# EAGLE design M3_Shield_Solar_V1.2 (EAGLE 9.5.2)
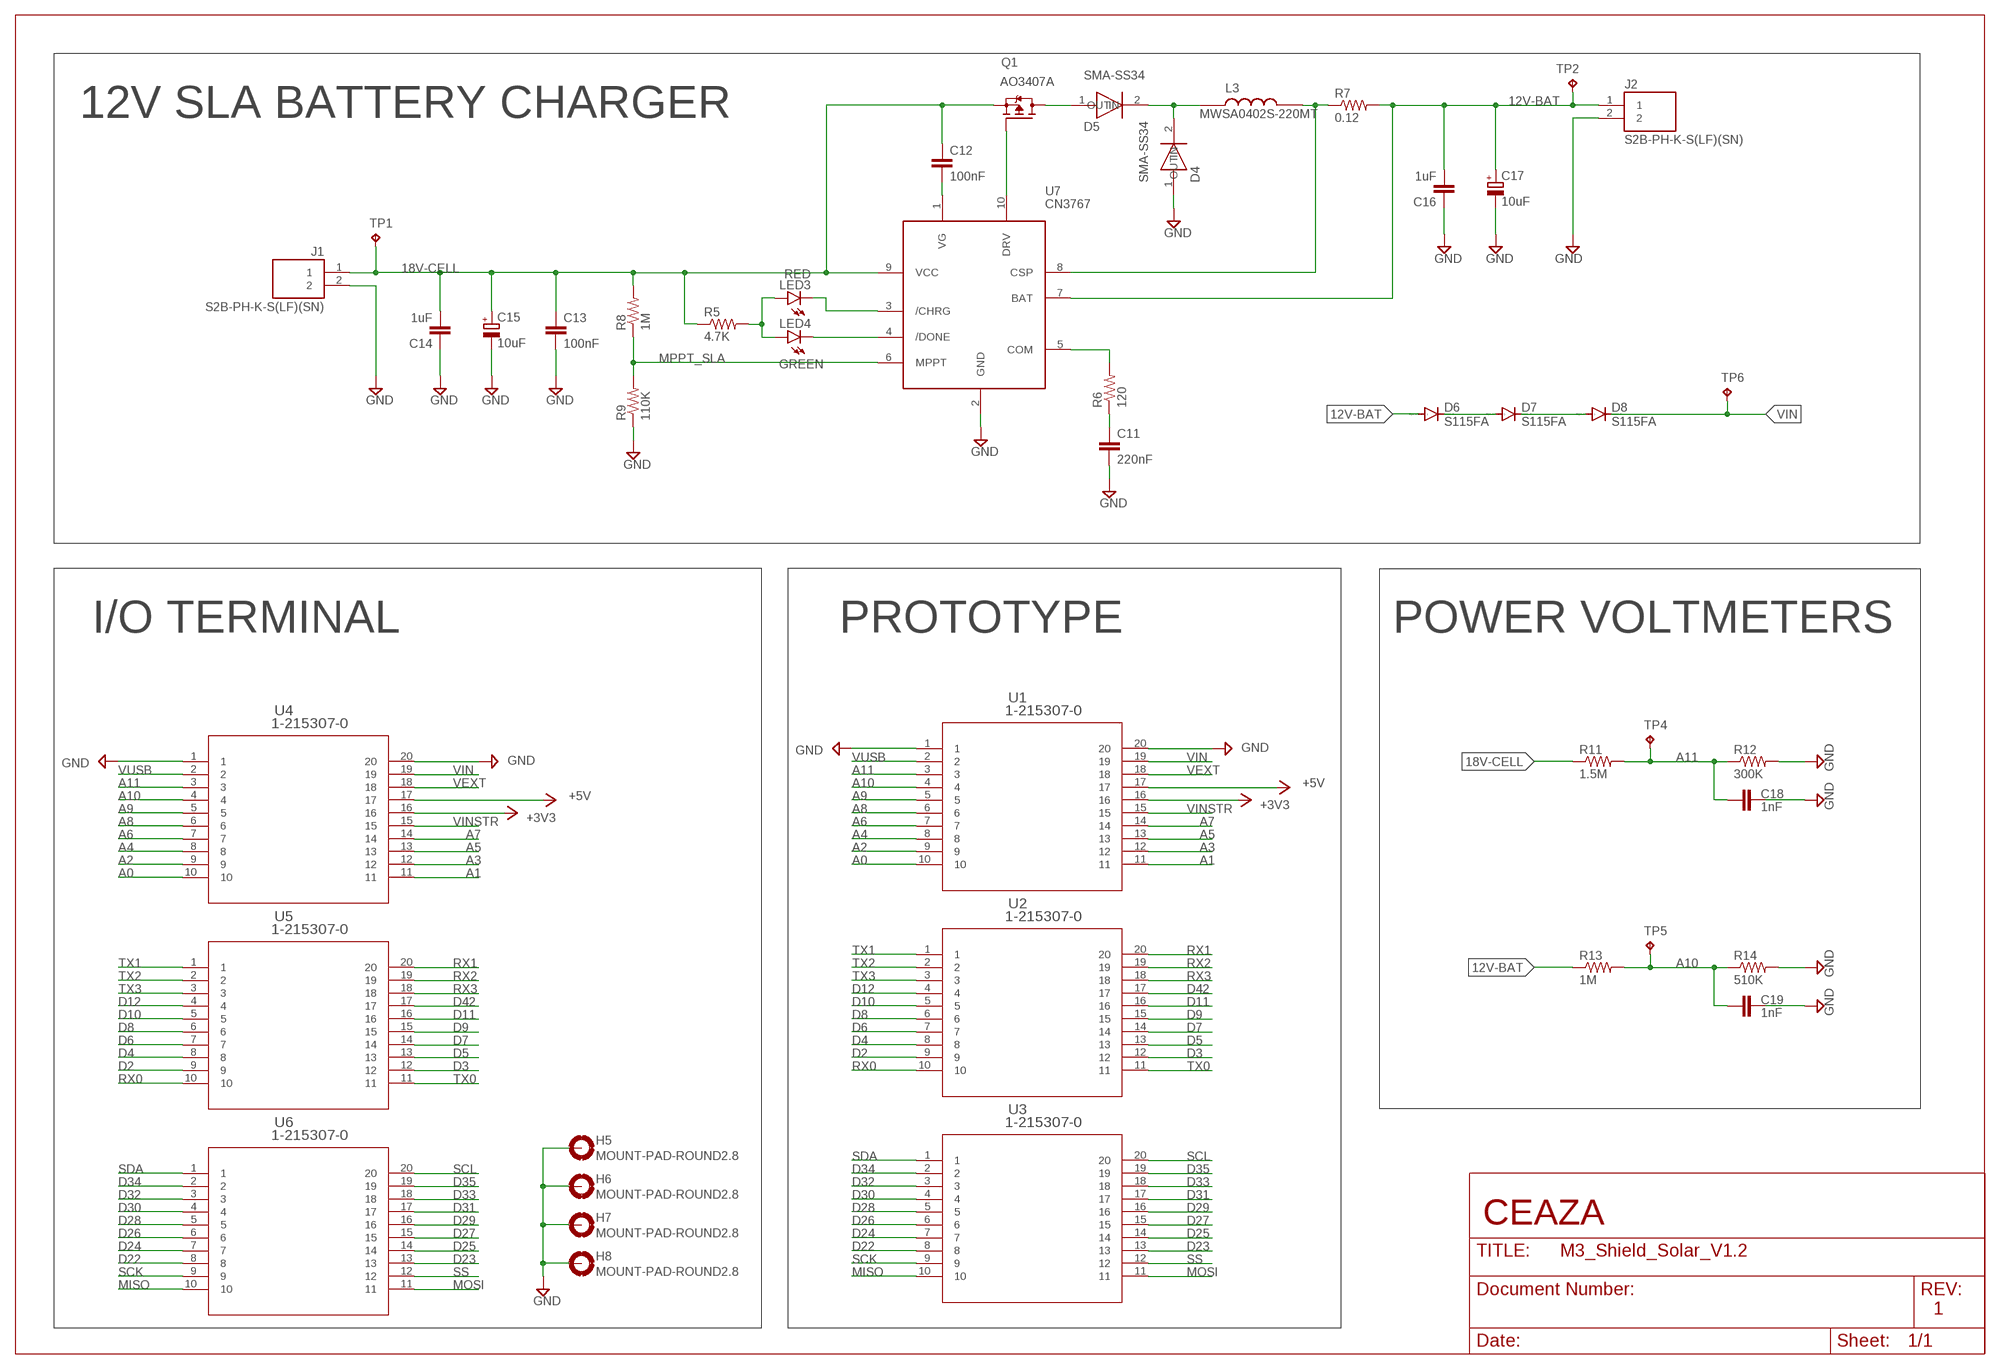
[diagram p0: schematic, sheet 1]

## Parts
C11  220nF  C-EUC0603K  [C0603K]
C12  100nF  C-EUC0603K  [C0603K]
C13  100nF  C-EUC0603K  [C0603K]
C14  1uF  C-EUC0603K  [C0603K]
C15  10uF  CPOL-EU153CLV-0505  [153CLV-0505]
C16  1uF  C-EUC0603K  [C0603K]
C17  10uF  CPOL-EU153CLV-0505  [153CLV-0505]
C18  1nF  C-EUC0603K  [C0603K]
C19  1nF  C-EUC0603K  [C0603K]
D4  SMA-SS34  [SMA-SS34]
D5  SMA-SS34  [SMA-SS34]
D6  S115FA  CGRM4001-G  [SOD-123_MINI-SMA]
D7  S115FA  CGRM4001-G  [SOD-123_MINI-SMA]
D8  S115FA  CGRM4001-G  [SOD-123_MINI-SMA]
H5  MOUNT-PAD-ROUND2.8  [2,8-PAD]
H6  MOUNT-PAD-ROUND2.8  [2,8-PAD]
H7  MOUNT-PAD-ROUND2.8  [2,8-PAD]
H8  MOUNT-PAD-ROUND2.8  [2,8-PAD]
J1  S2B-PH-K-S(LF)(SN)  [JST_S2B-PH-K-S(LF)(SN)]
J2  S2B-PH-K-S(LF)(SN)  [JST_S2B-PH-K-S(LF)(SN)]
L3  MWSA0402S-220MT  [MWSA0402S-220MT]
LED3  RED  LEDCHIPLED_0603  [CHIPLED_0603]
LED4  GREEN  LEDCHIPLED_0603  [CHIPLED_0603]
Q1  AO3407A  [SOT95P280X125-3N]
R5  4.7K  R-US_R0603  [R0603]
R6  120  R-US_R0603  [R0603]
R7  0.12  R-US_R0805  [R0805]
R8  1M  R-US_R0603  [R0603]
R9  110K  R-US_R0603  [R0603]
R11  1.5M  R-US_R0603  [R0603]
R12  300K  R-US_R0603  [R0603]
R13  1M  R-US_R0603  [R0603]
R14  510K  R-US_R0603  [R0603]
TP1  TPB1,27  [B1,27]
TP2  TPB1,27  [B1,27]
TP4  TPB1,27  [B1,27]
TP5  TPB1,27  [B1,27]
TP6  TPB1,27  [B1,27]
U1  1-215307-0  [1-215307-0]
U2  1-215307-0  [1-215307-0]
U3  1-215307-0  [1-215307-0]
U4  1-215307-0  [1-215307-0]
U5  1-215307-0  [1-215307-0]
U6  1-215307-0  [1-215307-0]
U7  CN3767  [CN3767]

## Nets
12V-BAT: C16.2 C17.+ D6.A J2.1 R7.2 R13.1 TP2.TP U7.7(BAT)
18V-CELL: C12.1 C13.1 C14.2 C15.+ J1.1 Q1.2(S) R5.1 R8.2 R11.1 TP1.TP U7.9(VCC)
+3V3: U1.16 U4.16
+5V: U1.17 U4.17
A0: U1.10 U4.10
A1: U1.11 U4.11
A2: U1.9 U4.9
A3: U1.12 U4.12
A4: U1.8 U4.8
A5: U1.13 U4.13
A6: U1.7 U4.7
A7: U1.14 U4.14
A8: U1.6 U4.6
A9: U1.5 U4.5
A10: C19.1 R13.2 R14.1 TP5.TP U1.4 U4.4
A11: C18.1 R11.2 R12.1 TP4.TP U1.3 U4.3
D2: U2.9 U5.9
D3: U2.12 U5.12
D4: U2.8 U5.8
D5: U2.13 U5.13
D6: U2.7 U5.7
D7: U2.14 U5.14
D8: U2.6 U5.6
D9: U2.15 U5.15
D10: U2.5 U5.5
D11: U2.16 U5.16
D12: U2.4 U5.4
D22: U3.8 U6.8
D23: U3.13 U6.13
D24: U3.7 U6.7
D25: U3.14 U6.14
D26: U3.6 U6.6
D27: U3.15 U6.15
D28: U3.5 U6.5
D29: U3.16 U6.16
D30: U3.4 U6.4
D31: U3.17 U6.17
D32: U3.3 U6.3
D33: U3.18 U6.18
D34: U3.2 U6.2
D35: U3.19 U6.19
D42: U2.17 U5.17
GND: C11.2 C13.2 C14.1 C15.- C16.1 C17.- C18.2 C19.2 D4.1(IN) H5.B2,8(MOUNT) H6.B2,8(MOUNT) H7.B2,8(MOUNT) H8.B2,8(MOUNT) J1.2 J2.2 R9.1 R12.2 R14.2 U1.1 U1.20 U4.1 U4.20 U7.2(GND)
MISO: U3.10 U6.10
MOSI: U3.11 U6.11
MPPT_SLA: R8.1 R9.2 U7.6(MPPT)
N$6: LED4.C U7.4(/DONE)
N$9: LED3.C U7.3(/CHRG)
N$10: LED3.A LED4.A R5.2
N$13: R6.2 U7.5(COM)
N$14: C11.1 R6.1
N$15: D6.C D7.A
N$16: D7.C D8.A
N$17: L3.P$2 R7.1 U7.8(CSP)
N$20: D4.2(OUT) D5.2(OUT) L3.P$1
N$23: C12.2 U7.1(VG)
N$24: Q1.1(G) U7.10(DRV)
N$25: D5.1(IN) Q1.3(D)
RX0: U2.10 U5.10
RX1: U2.20 U5.20
RX2: U2.19 U5.19
RX3: U2.18 U5.18
SCK: U3.9 U6.9
SCL: U3.20 U6.20
SDA: U3.1 U6.1
SS: U3.12 U6.12
TX0: U2.11 U5.11
TX1: U2.1 U5.1
TX2: U2.2 U5.2
TX3: U2.3 U5.3
VEXT: U1.18 U4.18
VIN: D8.C TP6.TP U1.19 U4.19
VINSTR: U1.15 U4.15
VUSB: U1.2 U4.2

## Notes on the sheet
- 12V SLA BATTERY CHARGER
- I/O TERMINAL | PROTOTYPE | POWER VOLTMETERS
- CEAZA
- 1

## Library data of the parts
C11-C14 C16 C18 C19 = rcl:C-EU: CAPACITOR, European symbol; SPICEPREFIX: C
C15 C17 = rcl:CPOL-EU: POLARIZED CAPACITOR, European symbol; SPICEPREFIX: C
D4 D5 = SMA-SS34:SMA-SS34
D6-D8 = diode:CGRM400*-G: Molded plasitc,JEDEC SOD-123/Mini SMA Source: Comchip CGRM4001-G.pdf
H5-H8 = holes:MOUNT-PAD-ROUND: MOUNTING PAD, round
J1 J2 = S2B-PH-K-S_LF__SN_:S2B-PH-K-S(LF)(SN): PH Series 2 Position 2.0 mm Through Hole Side Entry Shrouded Header; DESCRIPTION: Connector Header Through Hole, Right Angle 2 position; DIGI-KEY_PART_NUMBER: 455-1719-ND; DIGI-KEY_PURCHASE_URL: https://www.digikey.com/product-detail/en/jst-sales-america-inc/S2B-PH-K-S_LF__SN_/455-1719-ND/926626?utm_source=snapeda&utm_medium=aggregator&utm_campaign=symbol; MF: JST Sales America Inc.; MP: S2B-PH-K-S_LF__SN_; PACKAGE: Custom Package JST Sales America Inc.
L3 = MWSA0402S-220MT:MWSA0402S-220MT
LED3 LED4 = led:LED: LED OSRAM: - CHIPLED LG R971, LG N971, LY N971, LG Q971, LY Q971, LO R971, LY R971 LH N974, LH R974 LS Q976, LO Q976, LY Q976 LO Q996 - Hyper CHIPLED LW Q18S LB Q993, LB Q99A, LB R99A - SideLED LS A670, LO A670, LY A670, LG A670, LP A670 LB A673, LV A673, LT A673, LW A673 LH A674 LY A675 LS A676, LA A676, LO A676, LY A676, LW A676 LS A679, LY A679, LG A679 - Hyper Micro SIDELED® LS Y876, LA Y876, LO Y876, LY Y876 LT Y87S - SmartLED LW L88C, LW L88S LB L89C, LB L89S, LG L890 LS L89K, LO L89K, LY L89K LS L896, LA L896, LO L896, LY L896 - TOPLED LS T670, LO T670, LY T670, LG T670, LP T670 LSG T670, LSP T670, LSY T670, LOP T670, LYG T670 LG T671, LOG T671, LSG T671 LB T673, LV T673, LT T673, LW T673 LH T674 LS T676, LA T676, LO T676, LY T676, LB T676, LH T676, LSB T676, LW T676 LB T67C, LV T67C, LT T67C, LS T67K, LO T67K, LY T67K, LW E67C LS E67B, LA E67B, LO E67B, LY E67B, LB E67C, LV E67C, LT E67C LW T67C LS T679, LY T679, LG T679 LS T770, LO T770, LY T770, LG T770, LP T770 LB T773, LV T773, LT T773, LW T773 LH T774 LS E675, LA E675, LY E675, LS T675 LS T776, LA T776, LO T776, LY T776, LB T776 LHGB T686 LT T68C, LB T68C - Hyper Mini TOPLED® LB M676 - Mini TOPLED Santana® LG M470 LS M47K, LO M47K, LY M47K Source: http://www.osram.convergy.de LUXEON: - LUMILED® LXK2-PW12-R00, LXK2-PW12-S00, LXK2-PW14-U00, LXK2-PW14-V00 LXK2-PM12-R00, LXK2-PM12-S00, LXK2-PM14-U00 LXK2-PE12-Q00, LXK2-PE12-R00, LXK2-PE12-S00, LXK2-PE14-T00, LXK2-PE14-U00 LXK2-PB12-K00, LXK2-PB12-L00, LXK2-PB12-M00, LXK2-PB14-N00, LXK2-PB14-P00, LXK2-PB14-Q00 LXK2-PR12-L00, LXK2-PR12-M00, LXK2-PR14-Q00, LXK2-PR14-R00 LXK2-PD12-Q00, LXK2-PD12-R00, LXK2-PD12-S00 LXK2-PH12-R00, LXK2-PH12-S00 LXK2-PL12-P00, LXK2-PL12-Q00, LXK2-PL12-R00 Source: www.luxeon.com KINGBRIGHT: KA-3528ASYC Source: www.kingbright.com
Q1 = AO3407A:AO3407A: Transistor: P-MOSFET; unipolar; -30V; -4.3A; 1.4W; DESCRIPTION: P-Channel 30V 4.3A (Ta) 1.4W (Ta) Surface Mount SOT-23-3L; DIGI-KEY_PART_NUMBER: 785-1006-1-ND; DIGIKEY-PURCHASE-URL: https://snapeda.com/shop?store=DigiKey&id=547767; MF: Alpha &; MP: AO3407A; PACKAGE: SOT-23 Alpha &amp; Omega Semiconductor
R5-R9 R11-R14 = rcl:R-US_: RESISTOR, American symbol; SPICEPREFIX: R
TP1 TP2 TP4-TP6 = testpad:TP: Test pad
U1-U6 = 1-215307-0:1-215307-0; BUILT_BY: EMA_UL_Team; MANUFACTURER_PART_NUMBER: 1-215307-0; VENDOR: TE Connectivity
U7 = CN3767:CN3767

## Board
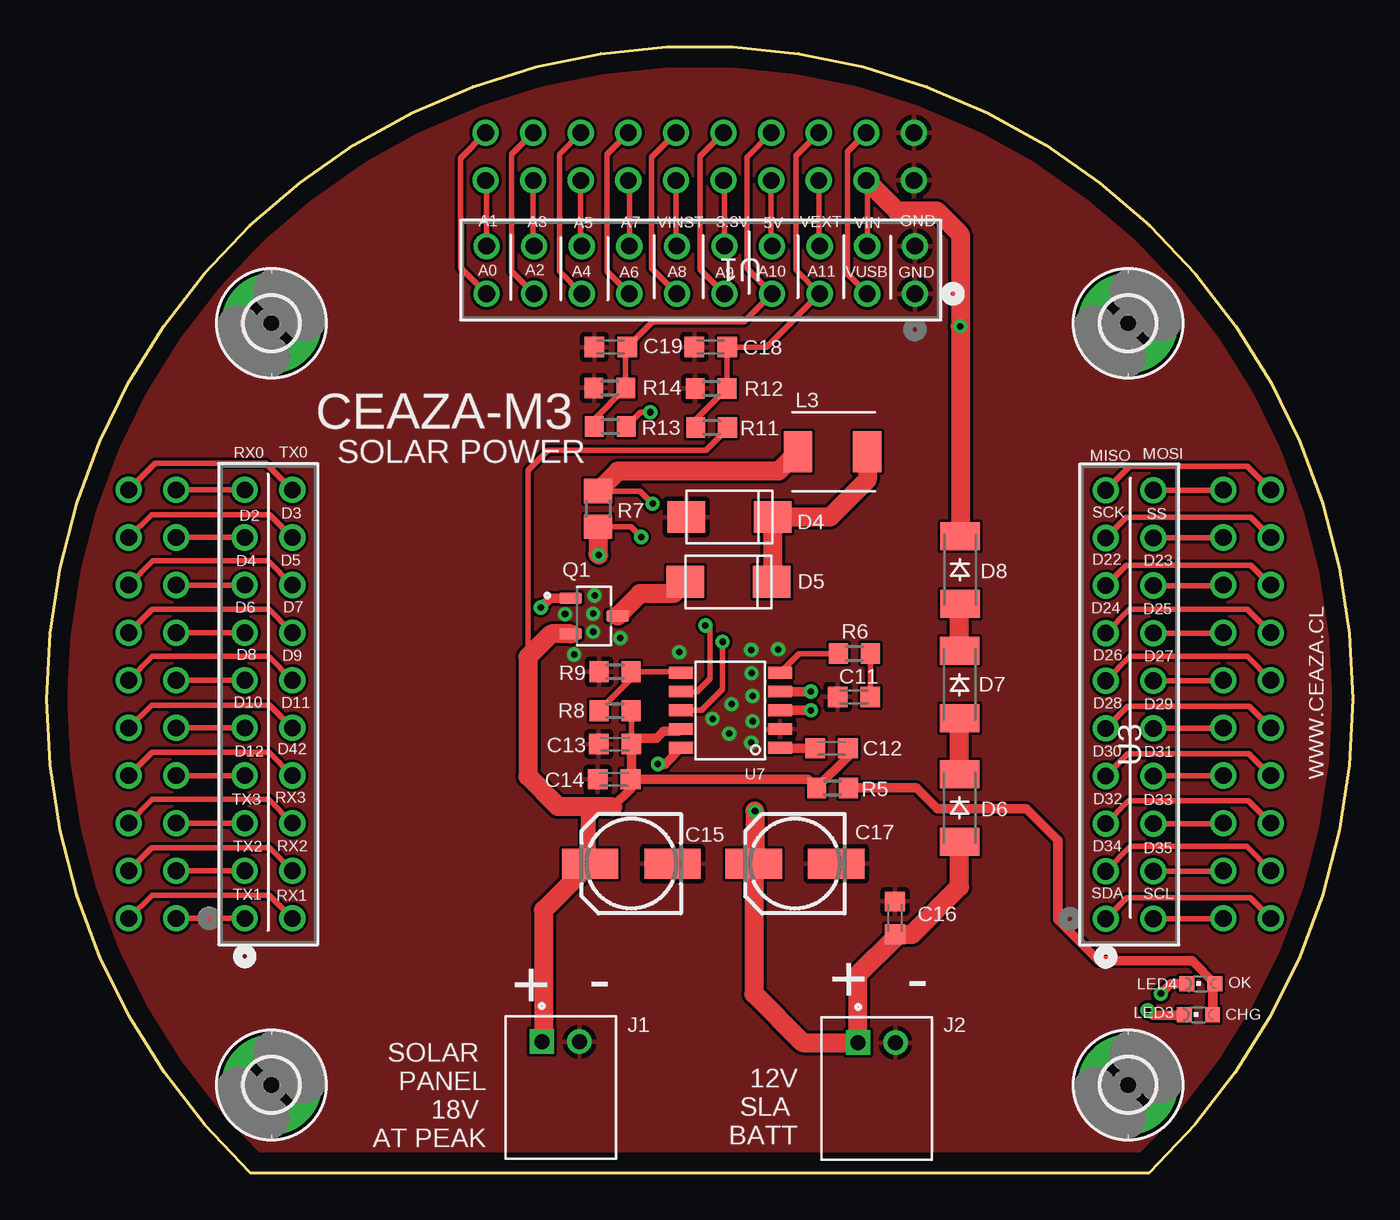
[diagram p1: board, top side]
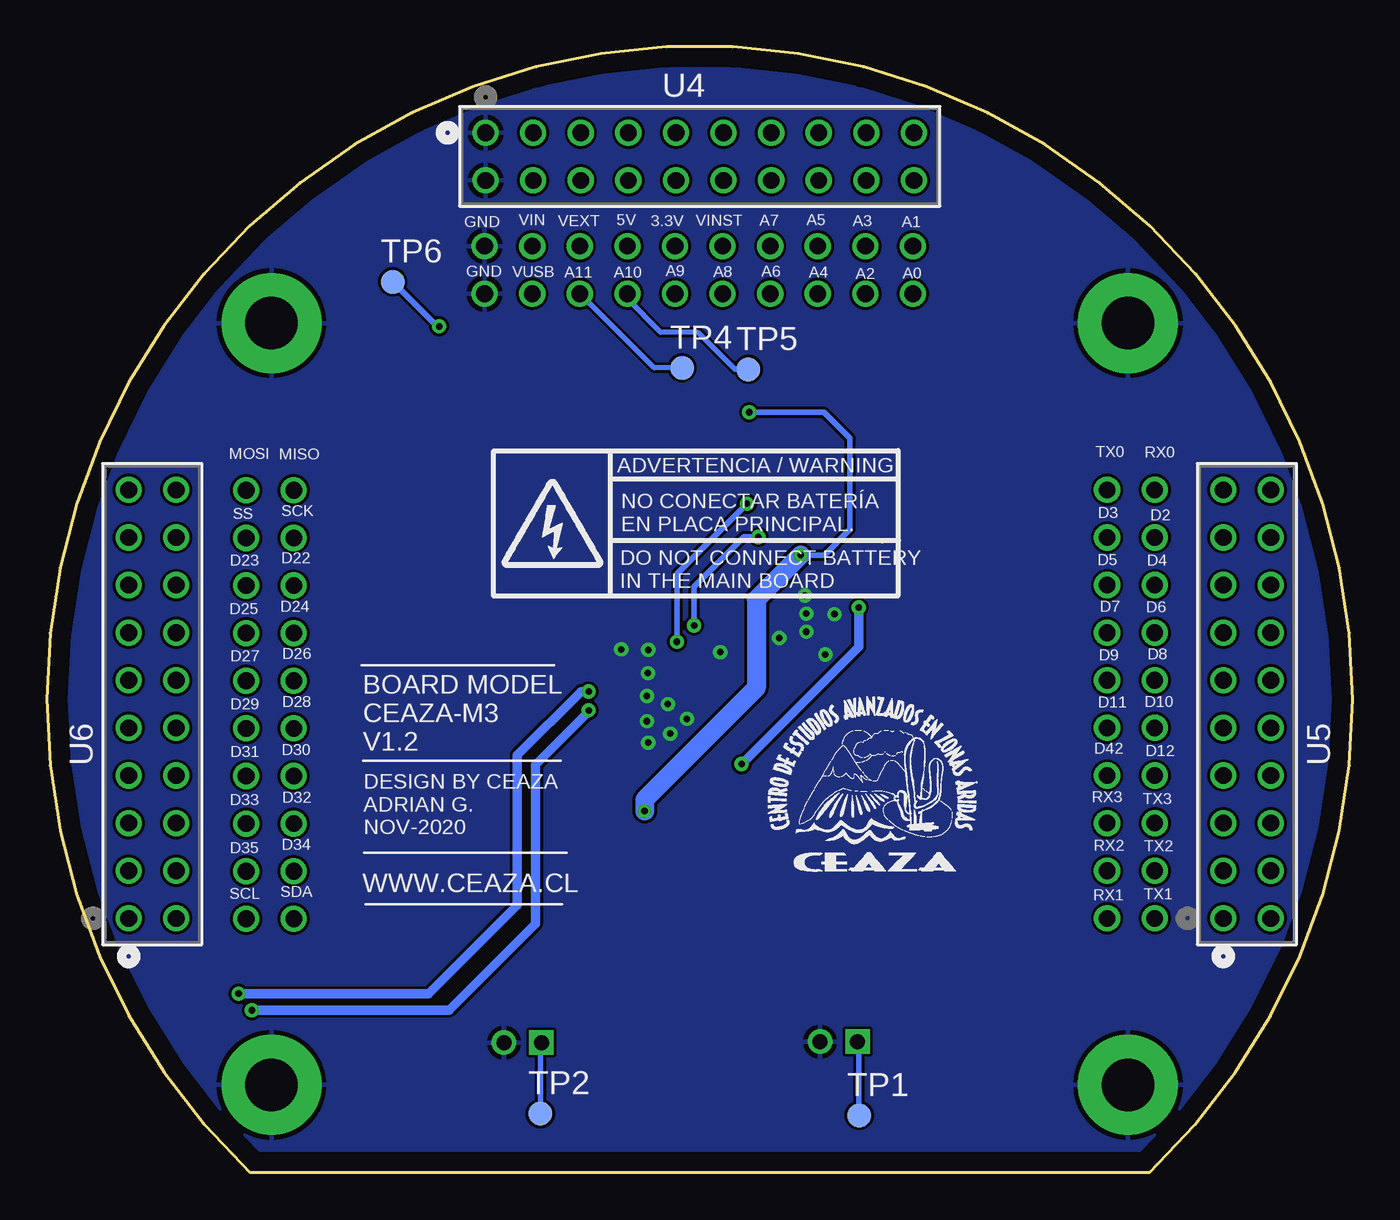
[diagram p2: board, bottom side, seen from below]

Size 69.69 x 60.06 mm. Coordinates in mm from the lower left corner, seen from the top.
Outline: 10.85,0 58.85,0 arc273 10.85,0
Copper layers (1*16): Top 0.035mm / dielectric 1.5mm / Bottom 0.035mm
Design rules "default *": minimum track width 6mil, minimum drill 0.35mm, track to track 6mil, track to pad 6mil, pad to pad 6mil, via to via 6mil, smd to smd 6mil, copper to edge 40mil, drill to drill 6mil, minimum pad ring 10mil, minimum via ring 8mil, stop-mask expansion 2mil, vias tented up to drill 24mil, thermal gap 10mil

### Footprints (pad centres in the part's own frame; a part is rotated, then mirrored left to right if it is on the bottom)
C0603K = smd 1.05 x 1.08: 1 -0.875,0; 2 0.875,0
153CLV-0505 = smd 3 x 1.6: + 2.2,0; - -2.2,0
SMA-SS34 = smd 2 x 1.7: 1 0,-1.4; 2 4.6,-1.4
SOD-123_MINI-SMA = smd 1.5 x 2.1: A 1.8,0; C -1.8,0
2,8-PAD = drill 2.8 pad 5.334: B2,8 0,0
JST_S2B-PH-K-S(LF)(SN) = drill 0.8 square: 1 -1,0 | drill 0.8: 2 1,0
MWSA0402S-220MT = smd 1.5 x 2.2: P$1 -1.8,0; P$2 1.9,0
CHIPLED_0603 = smd 0.8 x 0.8: A 0,-0.75; C 0,0.75
SOT95P280X125-3N = smd 1.21 x 0.59: 1 -1.255,0.95; 2 -1.255,-0.95; 3 1.255,0
R0603 = smd 1 x 1.1: 1 -0.85,0; 2 0.85,0
R0805 = smd 1.3 x 1.5: 1 -0.95,0; 2 0.95,0
B1,27 = smd 1.27 x 1.27: TP 0,0
1-215307-0 = drill 0.889 pad 1.397: 1 -22.86,2.54; 2 -20.32,2.54; 3 -17.78,2.54; 4 -15.24,2.54; 5 -12.7,2.54; 6 -10.16,2.54; 7 -7.62,2.54; 8 -5.08,2.54; 9 -2.54,2.54; 10 0,2.54; 11 0,0; 12 -2.54,0; 13 -5.08,0; 14 -7.62,0; 15 -10.16,0; 16 -12.7,0; 17 -15.24,0; 18 -17.78,0; 19 -20.32,0; 20 -22.86,0
CN3767 = smd 1.27 x 0.635: 1 -2.6,2; 2 -2.6,1; 3 -2.6,0; 4 -2.6,-1; 5 -2.6,-2; 6 2.67,-2; 7 2.67,-1; 8 2.67,0; 9 2.67,1; 10 2.67,2

### Placement (x,y rotation side)
C11  43.08,25.38 180 top
C12  41.88,22.64 180 top
C13  30.32,22.87 180 top
C14  30.27,20.99 0 top
C15  31.19,16.49 180 top
C16  45.26,13.6 270 top
C17  39.93,16.49 180 top
C18  35.43,44.05 180 top
C19  30.1,44.05 180 top
D4  34.13,36.38 0 top
D5  34.08,32.92 0 top
D6  48.71,19.46 270 top
D7  48.71,26.04 270 top
D8  48.74,32.16 270 top
H5  57.71,45.32 0 top
H6  11.99,45.32 0 top
H7  11.99,4.68 0 top
H8  57.71,4.68 0 top
J1  27.43,6.99 0 top
J2  44.29,6.94 0 top
L3  41.98,38.46 180 top
LED3  61.46,8.44 90 top
LED4  61.59,10.09 90 top
Q1  29.21,29.7 0 top
R5  41.93,20.53 0 top
R6  43.1,27.69 180 top
R7  29.41,35.41 270 top
R8  30.32,24.64 0 top
R9  30.32,26.73 0 top
R11  35.48,39.76 180 top
R12  35.46,41.84 180 top
R13  30.07,39.81 180 top
R14  30.05,41.87 180 top
TP1  26.34,3.05 0 bottom
TP2  43.35,3.16 0 bottom
TP4  35.79,42.93 0 bottom
TP5  32.25,42.86 0 bottom
TP6  51.23,47.53 0 bottom
U1  23.47,49.43 180 top
U2  13.1,36.43 90 top
U3  59.05,36.4 90 top
U4  23.42,52.94 0 bottom
U5  4.37,36.43 90 bottom
U6  62.79,36.43 90 bottom
U7  36.52,24.67 180 top

### Tracks (layer width: path | path; a pad name or v marks a point on that pad's centre or on a via)
12V-BAT  (via drill 0.35)
  Top 0.305: U7.7 34.7,25.67 35.38,26.35 35.38,28.96 v35.15,29.19 | v32.2,40.57 31.68,40.57 R13.1 | v31.72,33.91 31.17,34.46 R7.2
  Top 1.016: D6.A 48.71,15.25 46.19,12.72 C16.2 45.26,12.54 43.29,10.58 J2.1 40.33,6.94 37.73,9.54 C17.+ 37.79,16.56 v37.79,19.28 | R7.2 29.41,33 v29.46,32.95
  Bottom 0.305: v32.2,40.57 28.22,40.57 26.82,39.17 26.82,34.32 28.19,32.95 v29.46,32.95 | TP2.TP 43.35,6.88 J2.1 | v35.15,29.19 35.15,31.25 32.48,33.91 v31.72,33.91
  Bottom 1.016: v29.46,32.95 31.82,30.59 31.82,25.86 37.79,19.89 v37.79,19.28
18V-CELL
  Top 0.305: C13.1 31.2,24.62 R8.2 | 25.68,27.52 25.68,37.47 26.74,38.54 35.18,38.54 36.33,39.69 R11.1 | C14.2 31.33,21.16
  Top 0.508: U7.9 33.72,23.54 32.91,23.54 32.55,23.18 31.51,23.18 C13.1 31.2,21.04 C14.2 | R5.1 42.76,22.2 C12.1 | R5.1 41.06,20.5 | C14.2 31.15,20.46 30.2,19.51 | C14.2 40.62,20.99 R5.1
  Top 0.813: 28.89,19.55 28.89,16.59 C15.+
  Top 1.016: J1.1 26.5,7.07 26.5,14.01 C15.+ | Q1.2 26.91,28.75 25.68,27.52 25.68,21.14 27.27,19.55 28.89,19.55 28.92,19.51 30.2,19.51
  Bottom 0.305: TP1.TP 26.34,6.9 J1.1
+3V3
  Top 0.305: U4.16 36.17,52.89 U1.16
+5V
  Top 0.305: U1.17 38.66,49.49 U4.17
A0
  Top 0.305: U1.10 22.07,48.29 22.07,54.13 U4.10
A1
  Top 0.305: U1.11 23.47,52.89 U4.11
A2
  Top 0.305: U1.9 24.81,48.09 24.81,54.34 U4.9
A3
  Top 0.305: U4.12 25.96,49.49 U1.12
A4
  Top 0.305: U1.8 27.35,48.09 27.35,54.34 U4.8
A5
  Top 0.305: U1.13 28.5,49.49 U4.13
A6
  Top 0.305: U1.7 29.89,48.09 29.89,54.34 U4.7
A7
  Top 0.305: U4.14 31.09,52.89 U1.14
A8
  Top 0.305: U1.6 32.28,48.24 32.28,54.18 U4.6
A9
  Top 0.305: U1.5 34.87,48.19 34.87,54.23 U4.5
A10
  Top 0.305: R13.2 29.22,40.19 R14.1 30.89,43.97 C19.1 32.32,45.4 37.21,45.4 U1.4 37.36,48.24 37.36,54.18 U4.4
  Bottom 0.254: TP5.TP 32.97,42.86 34.95,44.84 36.93,44.84 38.71,46.61 U1.4
A11
  Top 0.305: R11.2 34.63,40.17 R12.1 C18.1 38.4,44.05 U1.3 39.98,48.16 39.98,54.26 U4.3
  Bottom 0.254: TP4.TP 37.28,42.93 U1.3
  Bottom 0.406: 35.75,42.89 TP4.TP
D2
  Top 0.305: U5.9 U2.9
D3
  Top 0.305: U5.12 5.58,35.11 11.88,35.11 U2.12
D4
  Top 0.305: U5.8 U2.8
D5
  Top 0.305: U5.13 5.66,32.64 11.81,32.64 U2.13
D6
  Top 0.305: U2.7 U5.7
D7
  Top 0.305: U5.14 5.61,30.05 11.86,30.05 U2.14
D8
  Top 0.305: U5.6 U2.6
D9
  Top 0.305: U5.15 5.64,27.54 11.83,27.54 U2.15
D10
  Top 0.305: U2.5 U5.5
D11
  Top 0.305: U5.16 5.58,24.95 11.88,24.95 U2.16
D12
  Top 0.305: U5.4 U2.4
D22
  Top 0.305: U3.8 57.6,32.42 64.26,32.42 U6.8
D23
  Top 0.305: U3.13 62.76,31.32 U6.13
D24
  Top 0.305: U3.7 57.78,30.05 64.08,30.05 U6.7
D25
  Top 0.305: U3.14 62.76,28.78 U6.14
D26
  Top 0.305: U3.6 57.81,27.54 64.06,27.54 U6.6
D27
  Top 0.305: U3.15 62.76,26.24 U6.15
D28
  Top 0.305: U3.5 57.68,24.87 64.18,24.87 U6.5
D29
  Top 0.305: U3.16 62.76,23.7 U6.16
D30
  Top 0.305: U3.4 57.71,22.36 64.16,22.36 U6.4
D31
  Top 0.305: U3.17 62.76,21.16 U6.17
D32
  Top 0.305: U3.3 57.73,19.84 64.13,19.84 U6.3
D33
  Top 0.305: U3.18 62.76,18.62 U6.18
D34
  Top 0.305: U3.2 57.83,17.41 64.03,17.41 U6.2
D35
  Top 0.305: U3.19 62.76,16.09 U6.19
D42
  Top 0.305: U5.17 5.61,22.43 11.86,22.43 U2.17
GND  (via drill 0.35)
  other vias: 27.66,29.8 28.14,27.64 29.16,29.83 29.16,28.86 30.6,28.53 29.23,30.79 33.75,27.77 37.59,27.9 39.04,27.92 37.61,26.65 37.67,25.43 36.55,25 37.67,24.09 35.53,24.21 36.42,23.43 37.59,22.94
  pour Top: -4.52,42.78 -4.52,13.57 10.72,-1.67 60.25,-1.67 70.41,8.49 70.41,40.24 48.82,61.83 14.53,61.83
  pour Bottom: -1.98,42.78 -1.98,11.03 11.99,-2.94 60.25,-2.94 70.41,7.22 70.41,41.51 50.09,61.83 17.07,61.83
MISO
  Top 0.305: U3.10 57.81,37.7 64.06,37.7 U6.10
MOSI
  Top 0.305: U3.11 62.76,36.41 U6.11
MPPT_SLA
  Top 0.305: R8.1 31.17,26.34 R9.2 33.79,26.73 U7.6
N$6  (via drill 0.35)
  Top 0.508: U7.4 v40.77,25.67 | LED4.C 59.99,10.09 v59.45,9.55
  Bottom 0.508: v40.77,25.67 41.19,25.67 44.58,22.27 44.58,14.28 49.31,9.55 v59.45,9.55
N$9  (via drill 0.35)
  Top 0.508: U7.3 v40.77,24.67 | v58.75,8.67 59.02,8.39 60.67,8.39 LED3.C
  Bottom 0.508: v40.77,24.67 40.77,24.6 43.62,21.75 43.62,13.28 48.23,8.67 v58.75,8.67
N$10
  Top 0.508: LED3.A 62.21,9.96 LED4.A 61.12,11.31 56.14,11.31 53.95,13.51 53.95,17.74 52.27,19.42 47.52,19.42 46.41,20.53 R5.2
N$13
  Top 0.305: U7.5 40.14,27.69 R6.2
N$14
  Top 0.305: R6.1 C11.1 | C11.1
N$15
  Top 1.016: D6.C D7.A
N$16
  Top 1.016: D7.C 48.71,30.34 D8.A
N$17  (via drill 0.35)
  Top 0.305: R7.1 31.66,36.36 v32.33,35.69 | v36.06,28.33 36.06,25.79 34.95,24.67 U7.8
  Top 1.016: L3.P$2 39.05,37.43 30.48,37.43 R7.1
  Bottom 0.305: v32.33,35.69 36.06,31.96 v36.06,28.33
N$20
  Top 1.016: D5.2 38.73,31.58 D4.2 41.8,34.98 43.78,36.96 L3.P$1
N$23
  Top 0.508: C12.2 39.15,22.64 U7.1
N$24  (via drill 0.35)
  Top 0.508: v32.61,21.8 32.98,21.8 U7.10 | v26.36,30.16 26.85,30.65 Q1.1
  Bottom 0.508: v32.61,21.8 26.36,28.05 v26.36,30.16
N$25
  Top 1.016: D5.1 33.45,30.89 31.66,30.89 Q1.3
RX0
  Top 0.305: U2.10 U5.10
RX1
  Top 0.305: U5.20 5.61,14.81 11.86,14.81 U2.20
RX2
  Top 0.305: U5.19 5.58,17.33 11.88,17.33 U2.19
RX3
  Top 0.305: U5.18 5.64,19.92 11.83,19.92 U2.18
SCK
  Top 0.305: U3.9 57.6,34.96 64.26,34.96 U6.9
SCL
  Top 0.305: U3.20 62.76,13.54 U6.20
SDA
  Top 0.305: U3.1 57.63,14.66 64.23,14.66 U6.1
SS
  Top 0.305: U3.12 62.76,33.86 U6.12
TX0
  Top 0.305: U5.11 5.79,37.85 11.68,37.85 U2.11
TX1
  Top 0.305: U2.1 U5.1
TX2
  Top 0.305: U5.2 U2.2
TX3
  Top 0.305: U2.3 U5.3
VEXT
  Top 0.305: U4.18 41.2,49.49 U1.18
VIN  (via drill 0.35)
  Top 0.305: U1.19 43.79,52.89 U4.19
  Top 1.016: U4.19 45.36,51.31 47.49,51.31 48.75,50.06 v48.75,45.16 48.76,45.14 48.76,33.99 D8.C
  Bottom 0.305: v48.75,45.16 48.85,45.16 TP6.TP
VINSTR
  Top 0.305: U1.15 33.58,49.49 U4.15
VUSB
  Top 0.305: U1.2 42.72,47.96 42.72,54.46 U4.2

### Text on the board
tPlace: CEAZA-M3 | SOLAR POWER | WWW.CEAZA.CL | - | + | - | OK | + | CHG | SOLAR / PANEL / 18V / AT PEAK | 12V / SLA / BATT
bPlace: ADVERTENCIA / WARNING | NO CONECTAR BATERÍA / EN PLACA PRINCIPAL. | DO NOT CONNECT BATTERY / IN THE MAIN BOARD | BOARD MODEL / CEAZA-M3 / V1.2 | DESIGN BY CEAZA / ADRIAN G. / NOV-2020 | WWW.CEAZA.CL
tNames: A1 | A3 | A5 | A7 | VINST | 3.3V | 5V | VEXT | VIN | GND | A0 | A2 | A4 | A6 | A8 | A9 | A10 | A11 | VUSB | GND | RX0 | TX0 | MISO | MOSI | D3 | SCK | D2 | SS | D4 | D5 | D22 | D23 | D7 | D6 | D24 | D25 | D8 | D9 | D26 | D27 | D10 | D11 | D28 | D29 | D12 | D42 | D30 | D31 | TX3 | RX3 | D32 | D33 | TX2 | RX2 | D34 | D35 | TX1 | RX1 | SDA | SCL
bNames: A1 | A3 | A5 | A7 | VINST | 3.3V | 5V | VEXT | VIN | GND | A0 | A2 | A4 | A6 | A8 | A9 | A10 | A11 | VUSB | GND | RX0 | TX0 | MISO | MOSI | D3 | SCK | D2 | SS | D4 | D5 | D22 | D23 | D6 | D7 | D24 | D25 | D8 | D9 | D26 | D27 | D10 | D11 | D28 | D29 | D12 | D42 | D30 | D31 | TX3 | RX3 | D32 | D33 | TX2 | RX2 | D34 | D35 | TX1 | RX1 | SDA | SCL